# EAGLE design Project_02_PCB (EAGLE 9.5.1)
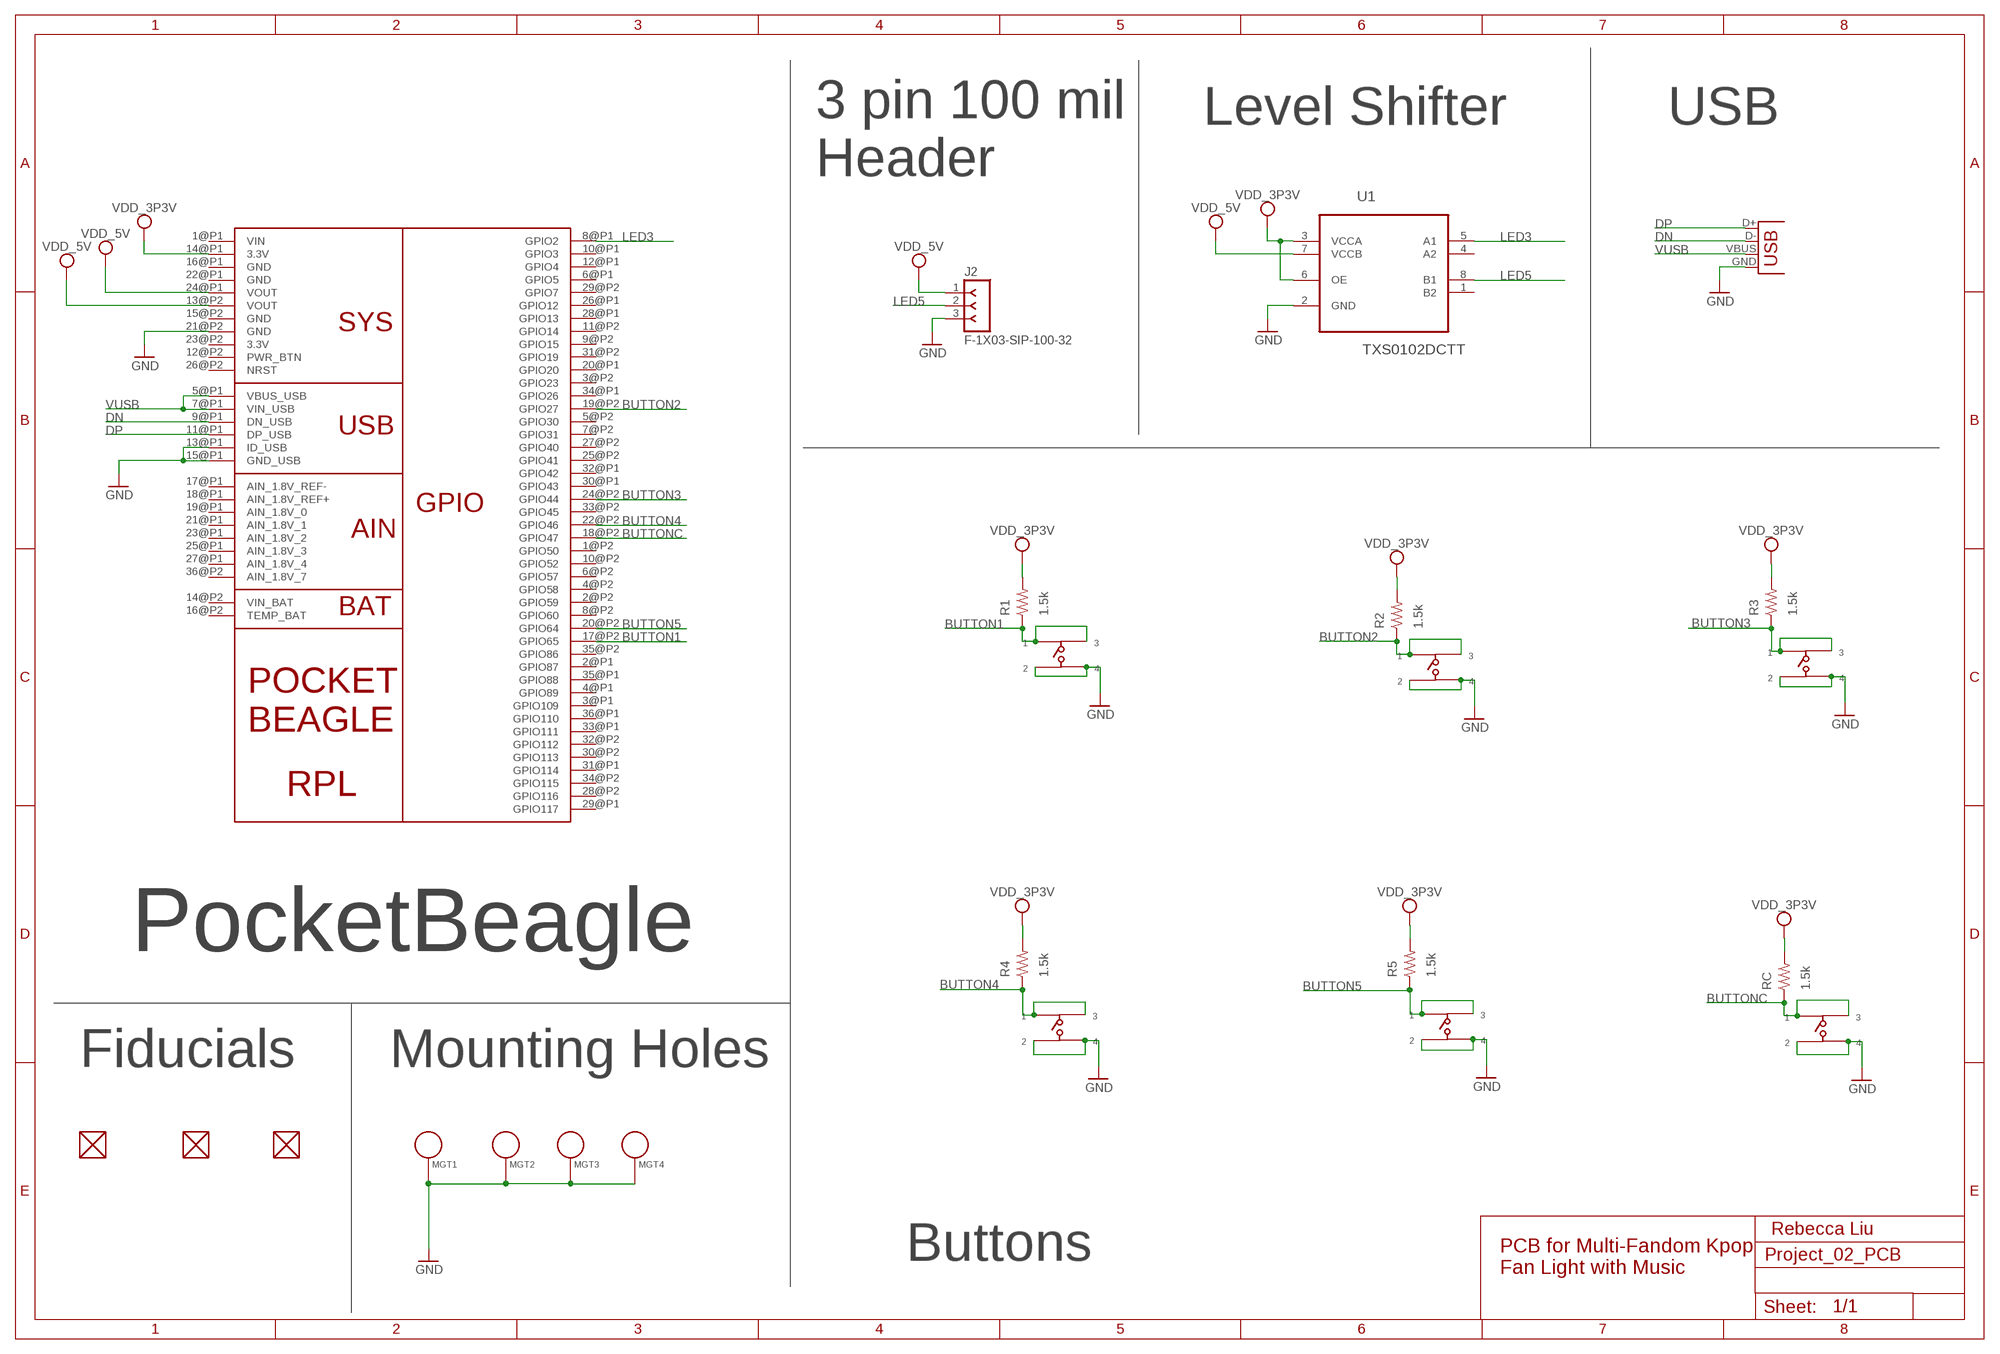
[diagram p0: schematic, sheet 1]

## Parts
FUD1  FIDUCIAL  [FIDUCIAL_40MIL]
FUD2  FIDUCIAL  [FIDUCIAL_40MIL]
FUD3  FIDUCIAL  [FIDUCIAL_40MIL]
J2  F-1X03-SIP-100-32  [SIP-100-03-32]
MGT1  MOUNTING_HOLE  [MOUNTING_HOLE]
MGT2  MOUNTING_HOLE  [MOUNTING_HOLE]
MGT3  MOUNTING_HOLE  [MOUNTING_HOLE]
MGT4  MOUNTING_HOLE  [MOUNTING_HOLE]
R1  1.5k  R_R0603  [R0603]
R2  1.5k  R_R0603  [R0603]
R3  1.5k  R_R0603  [R0603]
R4  1.5k  R_R0603  [R0603]
R5  1.5k  R_R0603  [R0603]
RC  1.5k  R_R0603  [R0603]
U1  TXS0102DCTT  [SOP65P400X130-8N]
U$1  BUTTON  [BUTTON]
U$2  BUTTON  [BUTTON]
U$3  BUTTON  [BUTTON]
U$4  BUTTON  [BUTTON]
U$5  POCKETBEAGLE  [POCKETBEAGLE]
U$6  BUTTON  [BUTTON]
U$7  BUTTON  [BUTTON]
X1  USB-A-S  [USB-A-S]

## Nets
BUTTON1: R1.1 U$1.P$1 U$1.P$3 U$5.17@P2(GPIO65)
BUTTON2: R2.1 U$2.P$1 U$2.P$3 U$5.19@P2(GPIO27)
BUTTON3: R3.1 U$5.24@P2(GPIO44) U$7.P$1 U$7.P$3
BUTTON4: R4.1 U$5.22@P2(GPIO46) U$6.P$1 U$6.P$3
BUTTON5: R5.1 U$4.P$1 U$4.P$3 U$5.20@P2(GPIO64)
BUTTONC: RC.1 U$3.P$1 U$3.P$3 U$5.18@P2(GPIO47)
DN: U$5.9@P1(DN_USB) X1.D-
DP: U$5.11@P1(DP_USB) X1.D+
GND: J2.3 MGT1.P$1 MGT2.P$1 MGT3.P$1 MGT4.P$1 U1.2(GND) U$1.P$2 U$1.P$4 U$2.P$2 U$2.P$4 U$3.P$2 U$3.P$4 U$4.P$2 U$4.P$4 U$5.13@P1(ID_USB) U$5.15@P1(GND_USB) U$5.21@P2(GND) U$6.P$2 U$6.P$4 U$7.P$2 U$7.P$4 X1.GND
LED3: U1.5(A1) U$5.8@P1(GPIO2)
LED5: J2.2 U1.8(B1)
VDD_3P3V: R1.2 R2.2 R3.2 R4.2 R5.2 RC.2 U1.3(VCCA) U1.6(OE) U$5.14@P1(3.3V)
VDD_5V: J2.1 U1.7(VCCB) U$5.13@P2(VOUT) U$5.24@P1(VOUT)
VUSB: U$5.5@P1(VBUS_USB) U$5.7@P1(VIN_USB) X1.VBUS
Unconnected: FUD1.P$1 FUD2.P$1 FUD3.P$1 U1.1(B2) U1.4(A2) U$5.1@P2(GPIO50) U$5.2@P1(GPIO87) U$5.2@P2(GPIO59) U$5.3@P1(GPIO109) U$5.3@P2(GPIO23) U$5.4@P1(GPIO89) U$5.4@P2(GPIO58) U$5.5@P2(GPIO30) U$5.6@P1(GPIO5) U$5.6@P2(GPIO57) U$5.7@P2(GPIO31) U$5.8@P2(GPIO60) U$5.9@P2(GPIO15) U$5.10@P1(GPIO3) U$5.10@P2(GPIO52) U$5.11@P2(GPIO14) U$5.12@P1(GPIO4) U$5.16@P2(TEMP_BAT) U$5.19@P1(AIN_1.8V_0) U$5.20@P1(GPIO20) U$5.21@P1(AIN_1.8V_1) U$5.23@P1(AIN_1.8V_2) U$5.23@P2(3.3V) U$5.25@P1(AIN_1.8V_3) U$5.25@P2(GPIO41) U$5.26@P1(GPIO12) U$5.26@P2(NRST) U$5.27@P1(AIN_1.8V_4) U$5.27@P2(GPIO40) U$5.28@P1(GPIO13) U$5.28@P2(GPIO116) U$5.29@P1(GPIO117) U$5.29@P2(GPIO7) U$5.30@P1(GPIO43) U$5.30@P2(GPIO113) U$5.31@P1(GPIO114) U$5.31@P2(GPIO19) U$5.32@P1(GPIO42) U$5.32@P2(GPIO112) U$5.33@P1(GPIO111) U$5.33@P2(GPIO45) U$5.34@P1(GPIO26) U$5.34@P2(GPIO115) U$5.35@P1(GPIO88) U$5.35@P2(GPIO86) U$5.36@P1(GPIO110) U$5.36@P2(AIN_1.8V_7)

## Notes on the sheet
- Level Shifter | USB
- 3 pin 100 mil 
  Header
- PocketBeagle
- Fiducials | Mounting Holes
- Rebecca Liu
- Buttons
- PCB for Multi-Fandom Kpop 
  Fan Light with Music

## Power pins joined to a net without a drawn wire
AIN_1.8V_REF+: U$5.18@P1(AIN_1.8V_REF+)
AIN_1.8V_REF-: U$5.17@P1(AIN_1.8V_REF-)
GND: U$5.15@P2(GND) U$5.16@P1(GND) U$5.22@P1(GND)
PWR_BTN: U$5.12@P2(PWR_BTN)
VIN: U$5.1@P1(VIN)
VIN_BAT: U$5.14@P2(VIN_BAT)

## Library data of the parts
FUD1-FUD3 = ENGI301:FIDUCIAL
J2 = Project_02:F-1X03-: FEMALE HEADER
MGT1-MGT4 = ENGI301:MOUNTING_HOLE: Chassis Mounting Hole w/GND connection ability
R1-R5 RC = ENGI301:R_: RESISTOR, American symbol
U1 = Project_02:TXS0102DCTT: BIDIRECTIONAL VOLTAGE-LEVEL TRANSLATOR; AVAILABILITY: Unavailable; DESCRIPTION: 2-Bit Bidirectional Voltage-Level Shifter for Open-Drain and Push-Pull Application 8-SM8 -40 to 85; MF: Texas Instruments; MP: TXS0102DCT; PACKAGE: LSSOP-8 Texas Instruments; PRICE: None
U$1-U$4 U$6 U$7 = Project_02:BUTTON
U$5 = Project_02:POCKETBEAGLE
X1 = Project_02:USB: USB Connectors

## Board
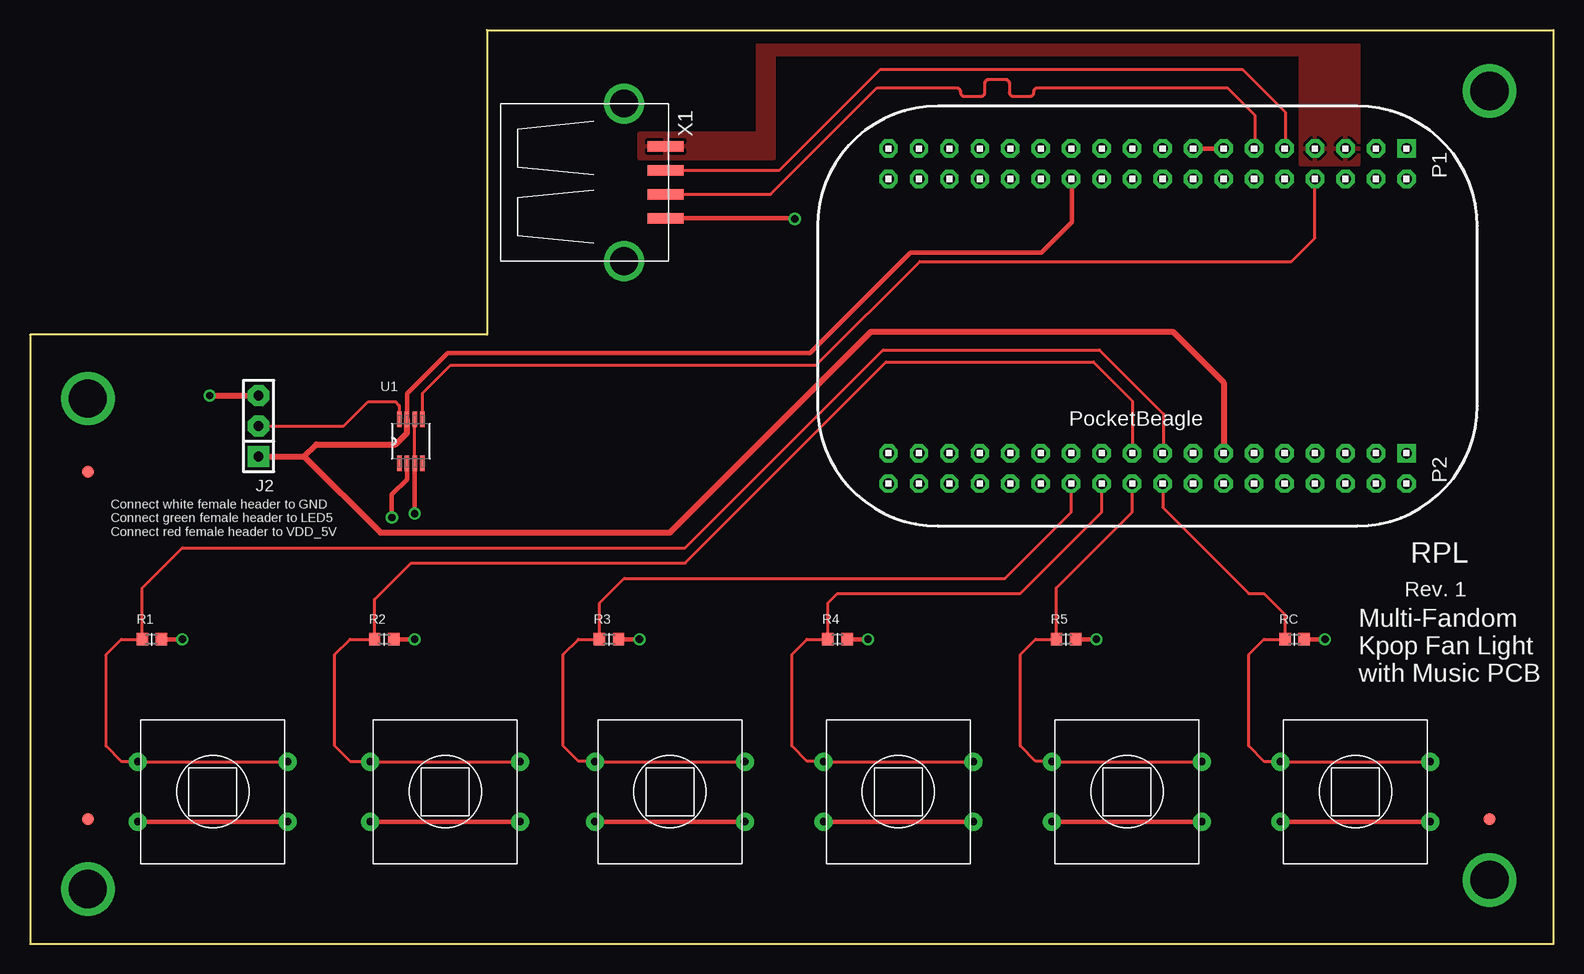
[diagram p1: board, top side]
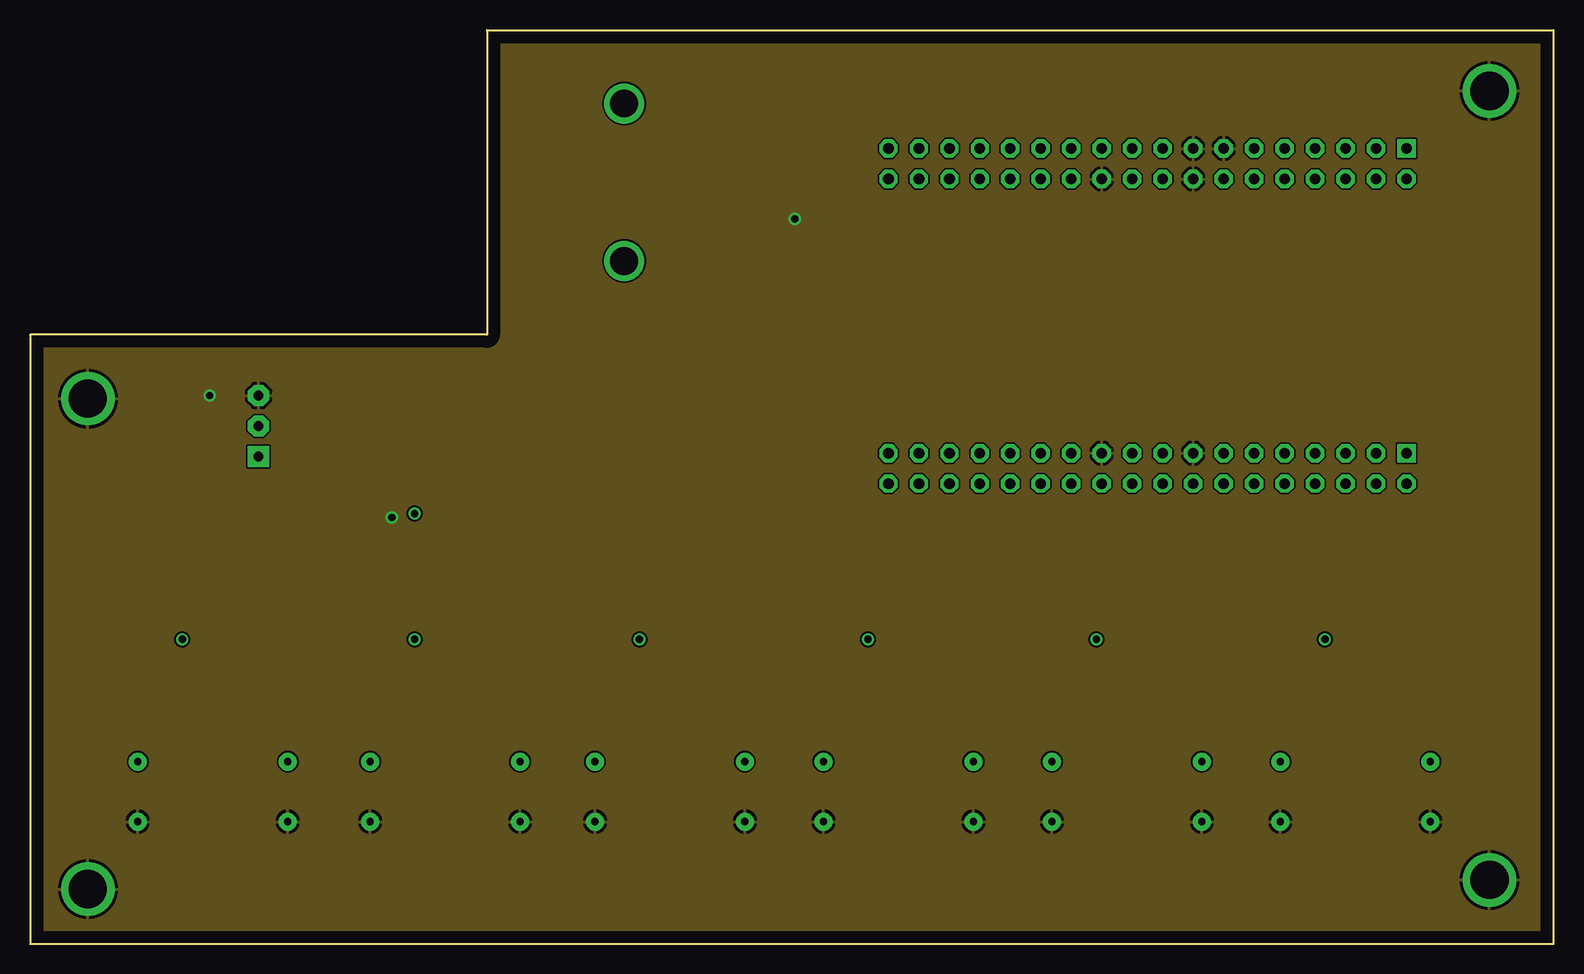
[diagram p2: board, inner layer Route2]
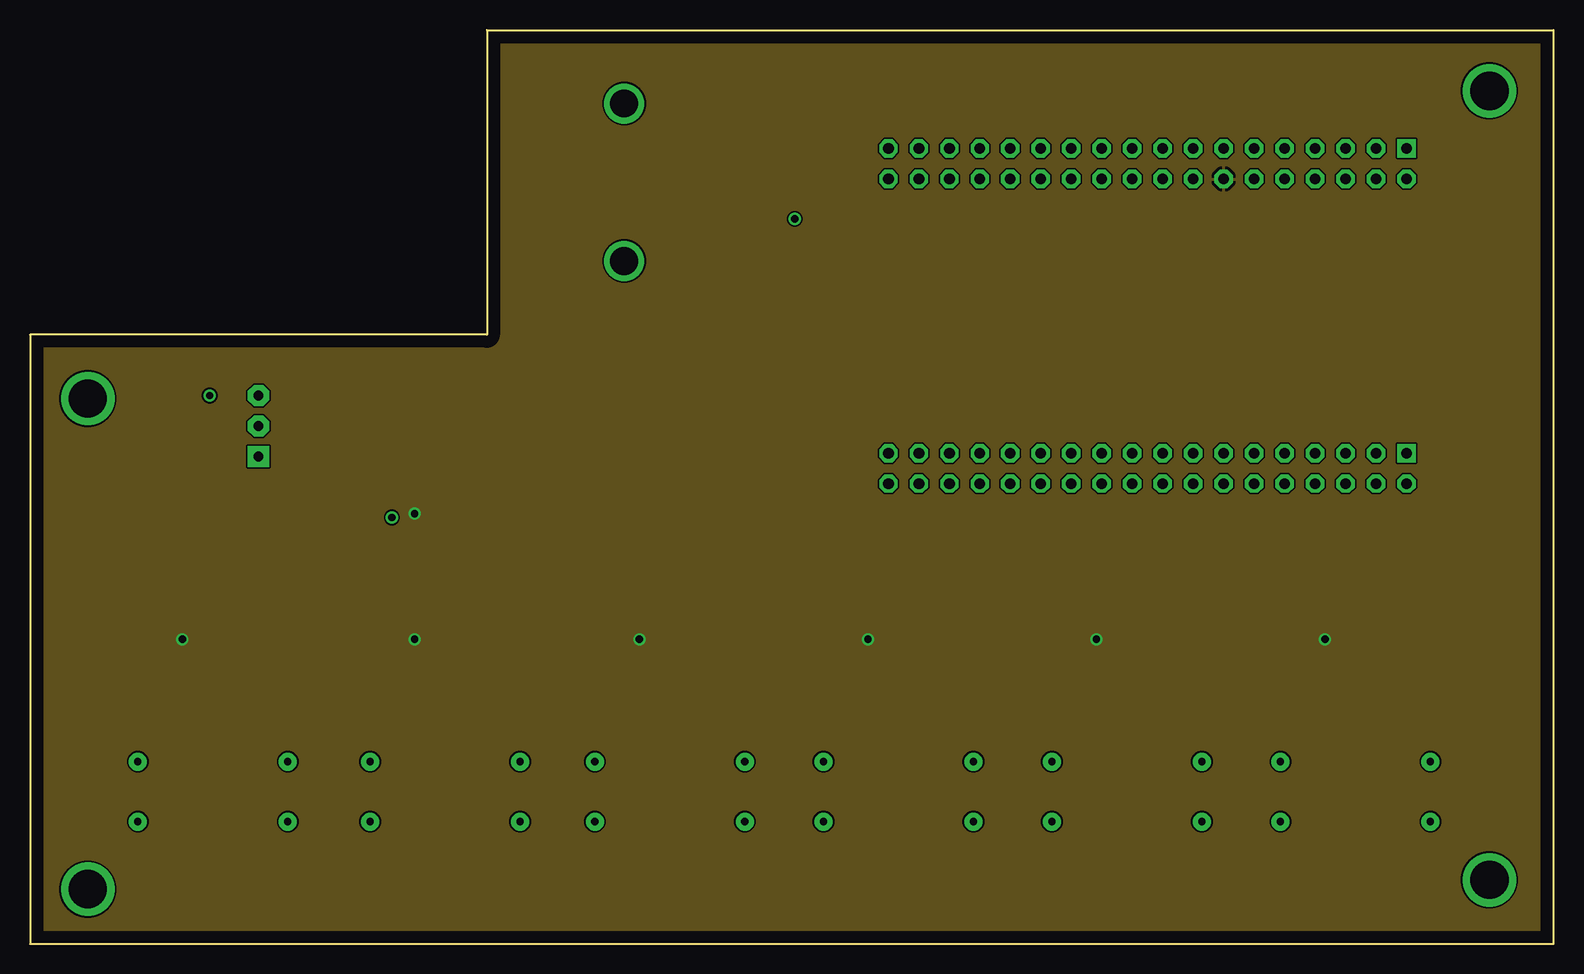
[diagram p3: board, inner layer Route15]

Size 127 x 76.2 mm. Coordinates in mm from the lower left corner, seen from the top.
Outline: 38.1,50.8 0,50.8 0,0 127,0 127,76.2 38.1,76.2 38.1,50.8
Copper layers (1+2*15+16): Top 0.035mm / dielectric 1.5mm / Route2 0.035mm / dielectric 0.15mm / Route15 0.035mm / dielectric 0.2mm / Bottom 0.035mm
Design rules "default *": minimum track width 6mil, minimum drill 0.35mm, track to track 6mil, track to pad 6mil, pad to pad 6mil, via to via 6mil, smd to smd 6mil, copper to edge 40mil, drill to drill 6mil, minimum pad ring 10mil, minimum via ring 8mil, stop-mask expansion 4mil, vias tented up to drill 0mil, thermal gap 10mil

### Footprints (pad centres in the part's own frame; a part is rotated, then mirrored left to right if it is on the bottom)
FIDUCIAL_40MIL = smd 1.016 x 1.016: P$1 0,0
SIP-100-03-32 = drill 0.813 pad 1.778 square: 1 -2.54,0 | drill 0.813 pad 1.778 octagon: 2 0,0; 3 2.54,0
MOUNTING_HOLE = drill 3.175 pad 4.445: P$1 0,0
R0603 = smd 0.95 x 1.031: 1 -0.8,0; 2 0.8,0
SOP65P400X130-8N = smd 1.321 x 0.356: 1 -1.829,0.965; 2 -1.829,0.33; 3 -1.829,-0.33; 4 -1.829,-0.965; 5 1.829,-0.965; 6 1.829,-0.33; 7 1.829,0.33; 8 1.829,0.965
BUTTON = drill 0.6 pad 1.5: P$1 -6.25,2.5; P$2 -6.25,-2.5; P$3 6.25,2.5; P$4 6.25,-2.5
POCKETBEAGLE = drill 0.889 pad 1.524 square: 1@P1 5.91,3.53; 1@P2 5.91,28.93 | drill 0.889 pad 1.524 octagon: 2@P1 5.91,6.07; 2@P2 5.91,31.47; 3@P1 8.45,3.53; 3@P2 8.45,28.93; 4@P1 8.45,6.07; 4@P2 8.45,31.47; 5@P1 10.99,3.53; 5@P2 10.99,28.93; 6@P1 10.99,6.07; 6@P2 10.99,31.47; 7@P1 13.53,3.53; 7@P2 13.53,28.93; 8@P1 13.53,6.07; 8@P2 13.53,31.47; 9@P1 16.07,3.53; 9@P2 16.07,28.93; 10@P1 16.07,6.07; 10@P2 16.07,31.47; 11@P1 18.61,3.53; 11@P2 18.61,28.93; 12@P1 18.61,6.07; 12@P2 18.61,31.47; 13@P1 21.15,3.53; 13@P2 21.15,28.93; 14@P1 21.15,6.07; 14@P2 21.15,31.47; 15@P1 23.69,3.53; 15@P2 23.69,28.93; 16@P1 23.69,6.07; 16@P2 23.69,31.47; 17@P1 26.23,3.53; 17@P2 26.23,28.93; 18@P1 26.23,6.07; 18@P2 26.23,31.47; 19@P1 28.77,3.53; 19@P2 28.77,28.93; 20@P1 28.77,6.07; 20@P2 28.77,31.47; 21@P1 31.31,3.53; 21@P2 31.31,28.93; 22@P1 31.31,6.07; 22@P2 31.31,31.47; 23@P1 33.85,3.53; 23@P2 33.85,28.93; 24@P1 33.85,6.07; 24@P2 33.85,31.47; 25@P1 36.39,3.53; 25@P2 36.39,28.93; 26@P1 36.39,6.07; 26@P2 36.39,31.47; 27@P1 38.93,3.53; 27@P2 38.93,28.93; 28@P1 38.93,6.07; 28@P2 38.93,31.47; 29@P1 41.47,3.53; 29@P2 41.47,28.93; 30@P1 41.47,6.07; 30@P2 41.47,31.47; 31@P1 44.01,3.53; 31@P2 44.01,28.93; 32@P1 44.01,6.07; 32@P2 44.01,31.47; 33@P1 46.55,3.53; 33@P2 46.55,28.93; 34@P1 46.55,6.07; 34@P2 46.55,31.47; 35@P1 49.09,3.53; 35@P2 49.09,28.93; 36@P1 49.09,6.07; 36@P2 49.09,31.47
USB-A-S = smd 3 x 0.9: D+ 3.45,-1; D- 3.45,1; GND 3.45,-3; VBUS 3.45,3 | drill 2.311: P$5 0,-6.566; P$6 0,6.566

### Placement (x,y rotation side)
FUD1  4.83,39.37 0 top
FUD2  4.83,10.41 0 top
FUD3  121.67,10.41 0 top
J2  19.05,43.18 90 top
MGT1  4.83,4.57 0 top
MGT2  4.83,45.47 0 top
MGT3  121.67,71.12 0 top
MGT4  121.67,5.33 0 top
R1  10.16,25.4 0 top
R2  29.53,25.4 0 top
R3  48.26,25.4 0 top
R4  67.31,25.4 0 top
R5  86.36,25.4 0 top
RC  105.41,25.4 0 top
U1  31.75,41.91 90 top
U$1  15.24,12.7 0 top
U$2  34.61,12.7 0 top
U$3  110.49,12.7 0 top
U$4  91.44,12.7 0 top
U$5  120.65,69.85 180 top
U$6  72.39,12.7 0 top
U$7  53.34,12.7 0 top
X1  49.53,63.5 0 top

### Tracks (layer width: path | path; a pad name or v marks a point on that pad's centre or on a via)
BUTTON1
  Top 0.254: U$5.17@P2 94.49,40.99 94.49,44.2 89.15,49.53 71.12,49.53 54.61,33.02 12.7,33.02 9.36,29.68 R1.1 7.62,25.4 6.35,24.13 6.35,16.51 7.66,15.2 U$1.P$1 U$1.P$3
BUTTON2
  Top 0.254: U$5.19@P2 91.88,45.28 88.65,48.51 71.37,48.51 54.61,31.75 31.75,31.75 28.73,28.73 R2.1 26.67,25.4 25.4,24.13 25.4,16.51 26.71,15.2 U$2.P$1 U$2.P$3
BUTTON3
  Top 0.254: U$5.24@P2 86.8,36 81.28,30.48 49.53,30.48 47.46,28.41 R3.1 45.72,25.4 44.45,24.13 44.45,16.51 45.72,15.24 47.05,15.24 U$7.P$1 U$7.P$3
BUTTON4
  Top 0.254: U$5.22@P2 89.34,36 82.55,29.21 67.31,29.21 66.51,28.41 R4.1 64.77,25.4 63.5,24.13 63.5,16.51 64.77,15.24 66.1,15.24 U$6.P$1 U$6.P$3
BUTTON5
  Top 0.254: U$5.20@P2 91.88,36 85.56,29.68 R5.1 83.82,25.4 82.55,24.13 82.55,16.51 83.82,15.24 85.15,15.24 U$4.P$1 U$4.P$3
BUTTONC
  Top 0.254: U$5.18@P2 94.42,36.39 101.6,29.21 102.87,29.21 104.61,27.47 RC.1 102.87,25.4 101.6,24.13 101.6,16.51 102.91,15.2 U$3.P$1 U$3.P$3
DN
  Top 0.254: X1.D- 62.47,64.5 70.87,72.9 101.09,72.9 104.65,69.34 104.65,66.39 U$5.9@P1
DP
  Top 0.254: X1.D+ 61.74,62.5 70.61,71.37 77.25,71.37 arc-90 77.56,71.06 77.56,70.99 arc90 77.88,70.67 79.29,70.67 arc90 79.6,70.99 79.6,71.76 arc-90 79.92,72.08 81.33,72.08 arc-90 81.64,71.76 81.64,70.99 arc90 81.96,70.67 83.36,70.67 arc90 83.68,70.99 83.68,71.06 arc-90 84,71.37 99.82,71.37 102.11,69.09 102.11,66.39 U$5.11@P1
GND  (via drill 0.61)
  Top 0.254: 63.71,60.5 v63.75,60.45
  Top 0.381: v30.16,35.56 30.16,37.47 31.42,38.72 U1.2 | U$5.15@P1 U$5.13@P1 | X1.GND 63.71,60.5 | U$1.P$2 U$1.P$4 | U$2.P$2 U$2.P$4 | U$7.P$2 U$7.P$4 | U$6.P$2 U$6.P$4 | U$4.P$2 U$4.P$4 | U$3.P$2 U$3.P$4
  Top 0.508: v14.99,45.72 J2.3
  pour Route2: -2.54,-2.54 -2.54,53.34 35.56,53.34 35.56,78.74 129.54,78.74 129.54,-2.54
LED3
  Top 0.254: U1.5 32.72,45.92 35.05,48.26 65.53,48.26 74.17,56.9 105.16,56.9 107.12,58.86 U$5.8@P1
LED5
  Top 0.254: U1.8 30.79,44.91 30.48,45.21 28.19,45.21 26.16,43.18 J2.2
VDD_3P3V  (via drill 0.61)
  Top 0.152: 32.07,40.07 U1.3
  Top 0.254: U1.3 U1.6
  Top 0.381: v12.7,25.4 R1.2 | v32.07,25.4 R2.2 | v107.95,25.4 RC.2 | v88.9,25.4 R5.2 | v69.85,25.4 R4.2 | v50.8,25.4 R3.2 | v32.07,35.88 32.07,40.07
  pour Route15: -5.08,-5.08 -5.08,55.88 33.02,55.88 33.02,81.28 132.08,81.28 132.08,-5.08
VDD_5V
  Top 0.254: 86.87,63.71 U$5.24@P1
  Top 0.381: 86.87,63.71 86.87,60.2 84.33,57.66 73.41,57.66 65.02,49.28 34.8,49.28 31.42,45.9 U1.7
  Top 0.508: 22.86,40.64 29.21,34.29 53.34,34.29 70.1,51.05 95.25,51.05 99.5,46.8 U$5.13@P2 | J2.1 22.86,40.64 | 22.86,40.64 23.88,41.66 30.48,41.66 31.42,42.6 U1.7
VUSB
  pour Top: 50.8,66.8 50.8,65.53 61.98,65.53 61.98,73.15 61.98,74.17 105.92,74.17 105.92,65.02 110.74,65.02 110.74,73.15 110.74,75.44 102.36,75.44 60.71,75.44 60.71,67.56 50.8,67.56

### Text on the board
tPlace: Connect white female header to GND / Connect green female header to LED5 / Connect red female header to VDD_5V | RPL | Rev. 1 | Multi-Fandom / Kpop Fan Light / with Music PCB